# Altium schematic sheet oled.SchDoc
size A4
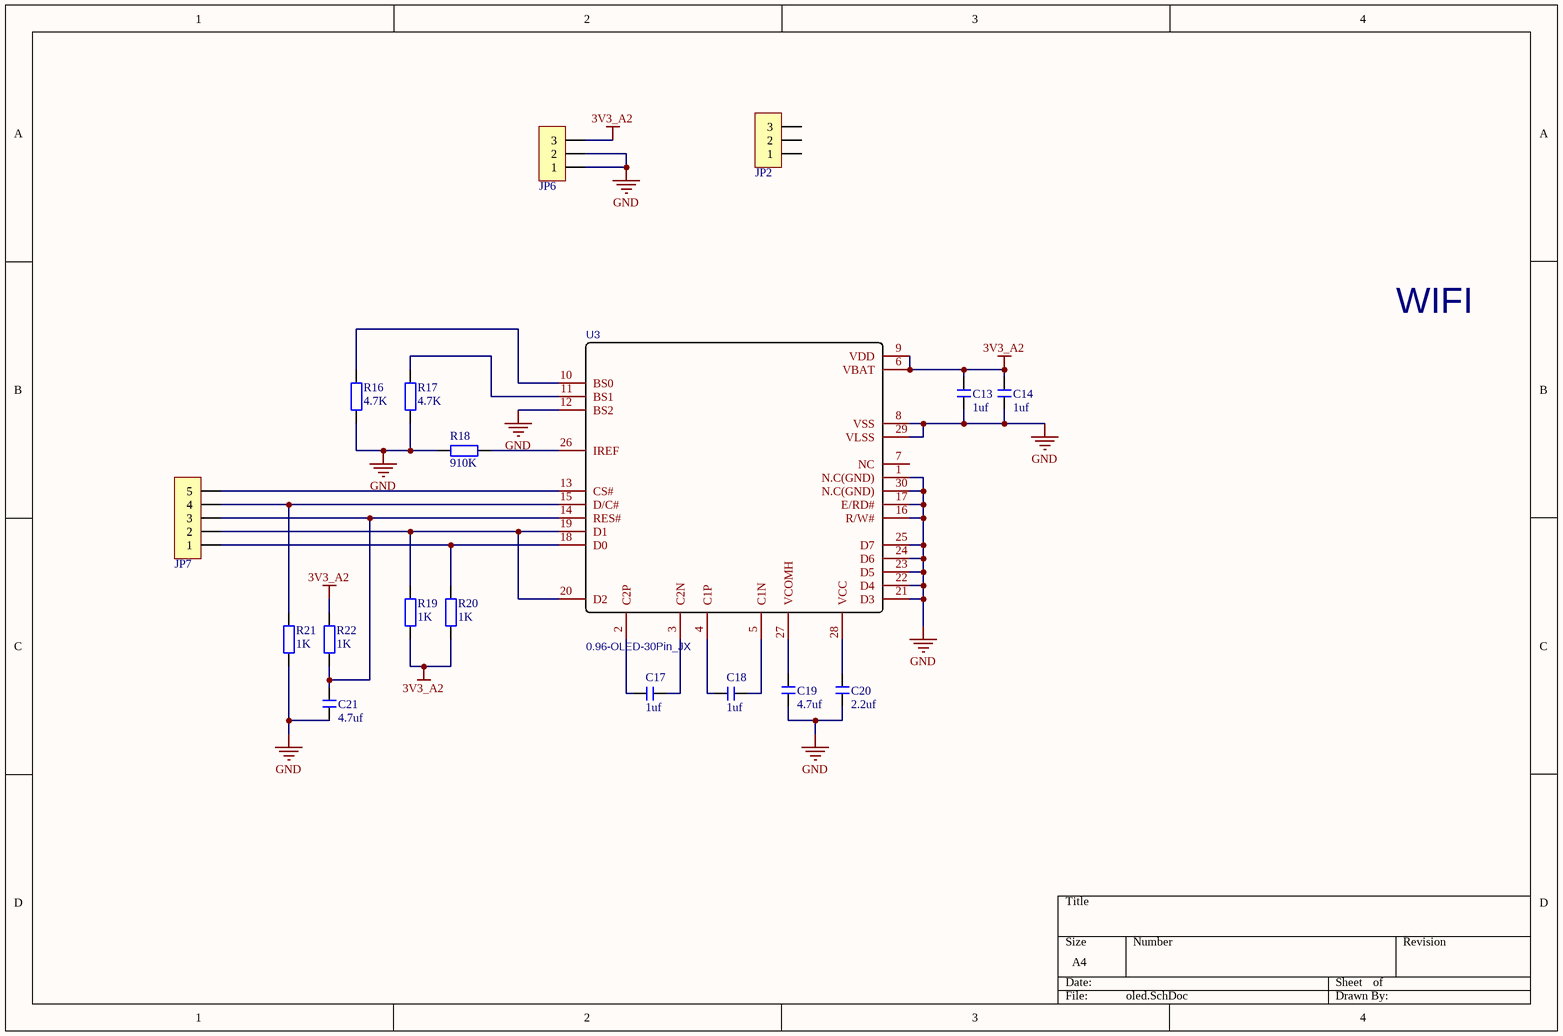
[diagram p0: oled.SchDoc]

## Parts
C13  1uf  [C 0603]
C14  1uf  [C 0603]
C17  1uf  [C 0603]
C18  1uf  [C 0603]
C19  4.7uf  [C 0603]
C20  2.2uf  [C 0603]
C21  4.7uf  [C 0603]
JP2  HDR-1X3  [OLED_3PIN]  (value not drawn)
JP6  HDR-1X3  [OLED_3PIN]  (value not drawn)
JP7  HDR-1X5  [OLED_5PIN]  (value not drawn)
R16  4.7K  [R 0603]
R17  4.7K  [R 0603]
R18  910K  [R 0603]
R19  1K  [R 0603]
R20  1K  [R 0603]
R21  1K  [R 0603]
R22  1K  [R 0603]
U3  0.96-OLED-30Pin_JX  [SSD1306-30PIN_JX]

## Nets
3V3_A2: C13.2 C14.2 JP6.3 R19.2 R20.2 R22.1 U3.6(VBAT) U3.9(VDD)
GND: C13.1 C14.1 C19.1 C20.1 C21.1 JP6.1 JP6.2 R16.2 R17.2 R18.1 R21.2 U3.1(N.C(GND)) U3.8(VSS) U3.12(BS2) U3.16(R/W#) U3.17(E/RD#) U3.21(D3) U3.22(D4) U3.23(D5) U3.24(D6) U3.25(D7) U3.29(VLSS) U3.30(N.C(GND))
NetC17_1: C17.1 U3.3(C2N)
NetC17_2: C17.2 U3.2(C2P)
NetC18_1: C18.1 U3.5(C1N)
NetC18_2: C18.2 U3.4(C1P)
NetC19_2: C19.2 U3.27(VCOMH)
NetC20_2: C20.2 U3.28(VCC)
NetC21_2: C21.2 JP7.3 R22.2 U3.14(RES#)
NetJP7_1: JP7.1 R20.1 U3.18(D0)
NetJP7_2: JP7.2 R19.1 U3.19(D1) U3.20(D2)
NetJP7_4: JP7.4 R21.1 U3.15(D/C#)
NetJP7_5: JP7.5 U3.13(CS#)
NetR16_1: R16.1 U3.10(BS0)
NetR17_1: R17.1 U3.11(BS1)
NetR18_2: R18.2 U3.26(IREF)

Not connected (* = marked no-connect by the designer): JP2 1 2 3; U3 7(NC)

## Notes on the sheet
- WIFI

## Library data of the parts
C13 C14 C17-C21 = C: 无极性贴片电容; 版权归属: 黎明电子style; BOM名称: 无极性贴片电容; 学习资源: https://lmdzstyle.taobao.com/
JP2 JP6 = Header 3: 3P接插件; 版权归属: 黎明电子style; BOM名称: 3P接插件; 学习资源: https://lmdzstyle.taobao.com/
JP7 = Header 5: 5P接插件; 版权归属: 黎明电子style; BOM名称: 5P接插件; 学习资源: https://lmdzstyle.taobao.com/
R16-R22 = R: 贴片电阻; 版权归属: 黎明电子style; BOM名称: 贴片电阻; 学习资源: https://lmdzstyle.taobao.com/
U3 = 0.96-OLED-30Pin_JX: spicePre: U; BOM_Supplier: LCSC